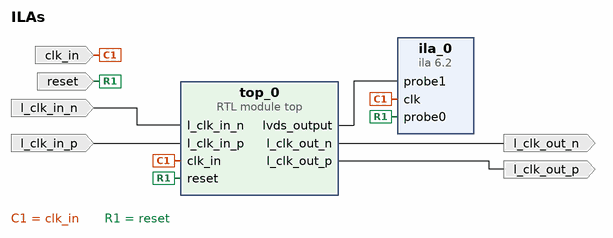
[diagram p0: block diagram of the top level]
# Vivado block design ILAs, xc7z020clg484-1, Vivado 2024.2
create_bd_design ILAs

create_bd_port -dir I clk_in
create_bd_port -dir I -type rst reset
create_bd_port -dir I l_clk_in_p
create_bd_port -dir I l_clk_in_n
create_bd_port -dir O l_clk_out_p
create_bd_port -dir O l_clk_out_n

create_bd_cell -type module -reference top top_0
create_bd_cell -type ip -vlnv xilinx.com:ip:ila:6.2 ila_0
set_property -dict {CONFIG.C_MONITOR_TYPE Native CONFIG.C_NUM_OF_PROBES 2} [get_bd_cells ila_0]

# ---- connections ----

connect_bd_net [get_bd_ports clk_in] [get_bd_pins ila_0/clk] [get_bd_pins top_0/clk_in]
connect_bd_net [get_bd_ports l_clk_in_n] [get_bd_pins top_0/l_clk_in_n]
connect_bd_net [get_bd_ports l_clk_in_p] [get_bd_pins top_0/l_clk_in_p]
connect_bd_net [get_bd_ports reset] [get_bd_pins ila_0/probe0] [get_bd_pins top_0/reset]
connect_bd_net [get_bd_pins top_0/l_clk_out_n] [get_bd_ports l_clk_out_n]
connect_bd_net [get_bd_pins top_0/l_clk_out_p] [get_bd_ports l_clk_out_p]
connect_bd_net [get_bd_pins top_0/lvds_output] [get_bd_pins ila_0/probe1]

validate_bd_design
save_bd_design
